# Altium schematic sheet MB1296-LRA_Module.SchDoc: LoRa Module
size A4; Date: 25-JAN-2017; Organization: STMicroelectronics; Address1: Microcontrollers Division; Address2: 190, avenue Célestin COQ; Address3: 13106 ROUSSET Cedex; Address4: FRANCE; DocumentNumber: MB1296; Revision: D-01; SheetNumber: 4; SheetTotal: 6; Project: STM32 LoRa Discovery
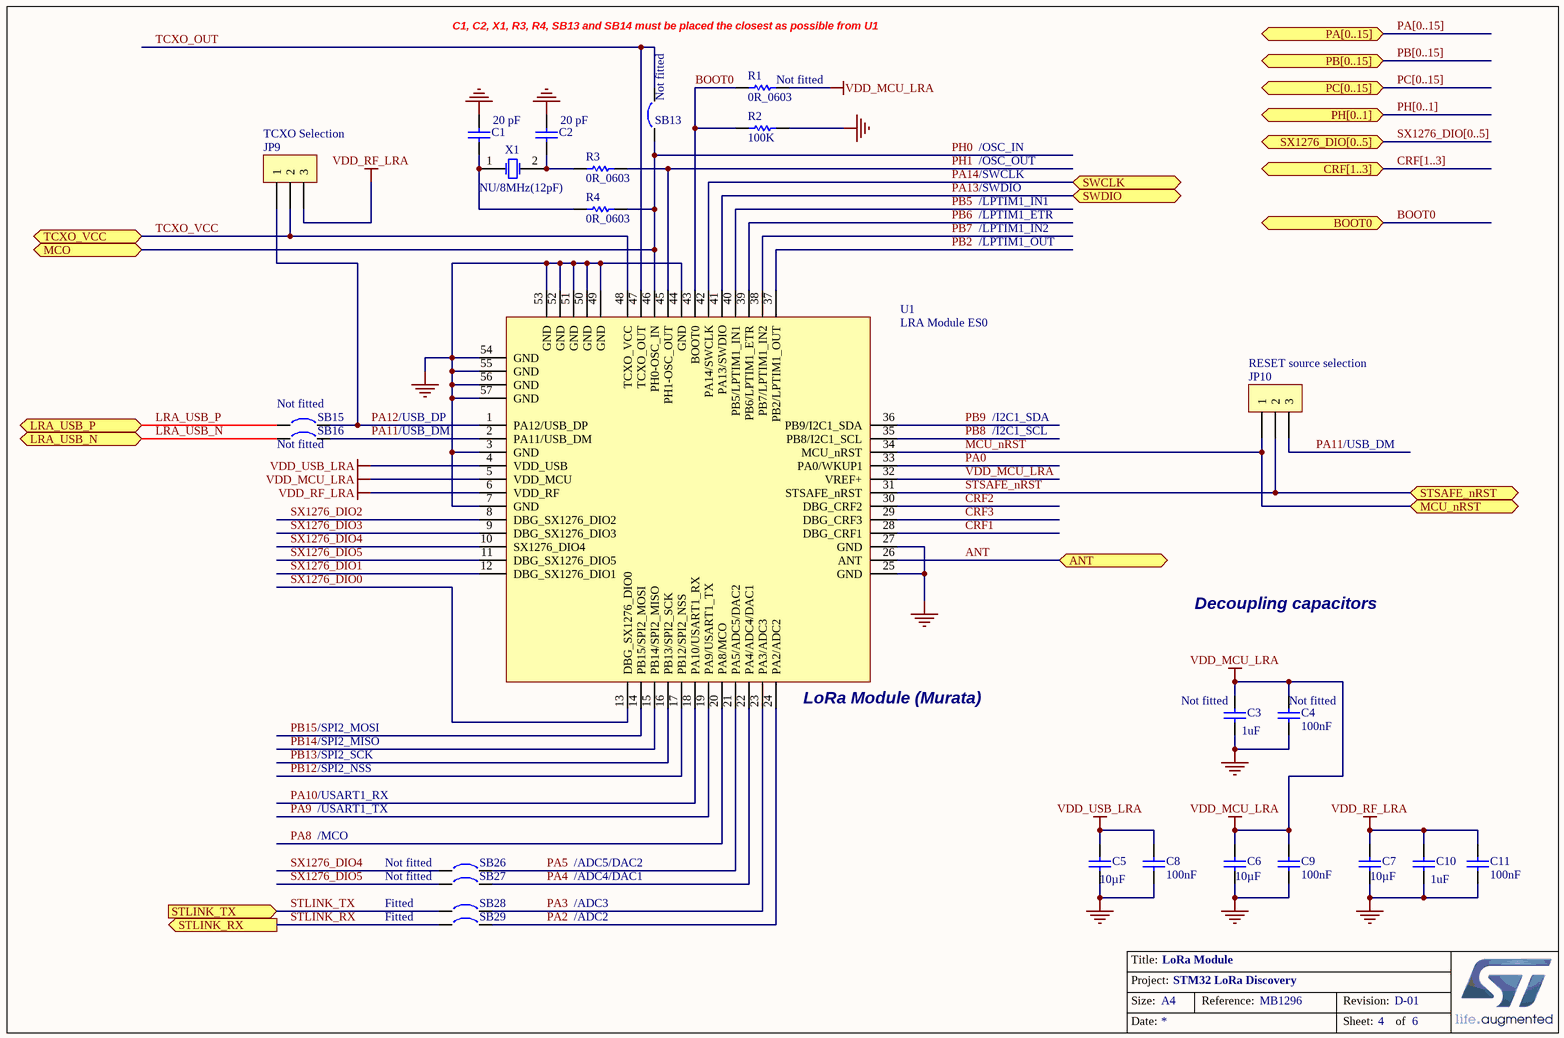
[diagram p0: MB1296-LRA_Module.SchDoc]

## Parts
C1  20 pF  [0603C]
C2  20 pF  [0603C]
C3  1uF  [0603C]
C4  100nF  [0603C]
C5  10µF  [0603C]
C6  10µF  [0603C]
C7  10µF  [0603C]
C8  100nF  [0603C]
C9  100nF  [0603C]
C10  1uF  [0603C]
C11  100nF  [0603C]
JP9  TCXO Selection  [SIP3]
JP10  RESET source selection  [SIP3]
R1  0R_0603  [0603]
R2  100K  [0603]
R3  0R_0603  [0603]
R4  0R_0603  [0603]
SB13  Circuit Breaker  [JP2_SMD]  (value not drawn)
SB15  Circuit Breaker  [JP2_SMD]  (value not drawn)
SB16  Circuit Breaker  [JP2_SMD]  (value not drawn)
SB26  Circuit Breaker  [JP2_SMD]  (value not drawn)
SB27  Circuit Breaker  [JP2_SMD]  (value not drawn)
SB28  Circuit Breaker  [JP2_SMD]  (value not drawn)
SB29  Circuit Breaker  [JP2_SMD]  (value not drawn)
U1  LRA Module ES0  [Lora Module ES0]
X1  NU/8MHz(12pF)  [CRY_NX3225GD_2P]

## Ports
ANT, BOOT0, CRF[1..3], LRA_USB_N, LRA_USB_P, MCO, MCU_nRST, PA[0..15] (bidir), PB[0..15] (bidir), PC[0..15] (bidir), PH[0..1] (bidir), STLINK_RX (out), STLINK_TX (in), STSAFE_nRST, SWCLK, SWDIO, SX1276_DIO[0..5] (bidir), TCXO_VCC

## Nets
GND: C1.2 C2.2 C3.1 C4.1 C5.2 C6.2 C7.2 C8.1 C9.1 C10.1 C11.1 R2.1 U1.3(GND) U1.7(GND) U1.25(GND) U1.27(GND) U1.44(GND) U1.49(GND) U1.50(GND) U1.51(GND) U1.52(GND) U1.53(GND) U1.54(GND) U1.55(GND) U1.56(GND) U1.57(GND)
VDD_MCU_LRA: C3.2 C4.2 C6.1 C9.2 R1.2 U1.5(VDD_MCU) U1.32(VREF+)
VDD_RF_LRA: C7.1 C10.2 C11.2 JP9.3 U1.6(VDD_RF)
VDD_USB_LRA: C5.1 C8.2 U1.4(VDD_USB)
ANT: U1.26(ANT) ; port ANT
BOOT0: R1.1 R2.2 U1.43(BOOT0) ; port BOOT0
CRF1: U1.28(DBG_CRF1)
CRF2: U1.30(DBG_CRF2)
CRF3: U1.29(DBG_CRF3)
LRA_USB_N: SB16.1 ; port LRA_USB_N
LRA_USB_P: SB15.1 ; port LRA_USB_P
MCU_nRST: JP10.1 U1.34(MCU_nRST) ; port MCU_nRST
PA0: U1.33(PA0/WKUP1)
PA2: SB29.2 U1.24(PA2/ADC2)
PA3: SB28.2 U1.23(PA3/ADC3)
PA4: SB27.2 U1.22(PA4/ADC4/DAC1)
PA5: SB26.2 U1.21(PA5/ADC5/DAC2)
PA8: U1.20(PA8/MCO)
PA9: U1.19(PA9/USART1_TX)
PA10: U1.18(PA10/USART1_RX)
PA11: JP10.3 SB16.2 U1.2(PA11/USB_DM)
PA12: JP9.1 SB15.2 U1.1(PA12/USB_DP)
PA13: U1.41(PA13/SWDIO) ; port SWDIO
PA14: U1.42(PA14/SWCLK) ; port SWCLK
PB2: U1.37(PB2/LPTIM1_OUT)
PB5: U1.40(PB5/LPTIM1_IN1)
PB6: U1.39(PB6/LPTIM1_ETR)
PB7: U1.38(PB7/LPTIM1_IN2)
PB8: U1.35(PB8/I2C1_SCL)
PB9: U1.36(PB9/I2C1_SDA)
PB12: U1.17(PB12/SPI2_NSS)
PB13: U1.16(PB13/SPI2_SCK)
PB14: U1.15(PB14/SPI2_MISO)
PB15: U1.14(PB15/SPI2_MOSI)
PH0: R4.2 SB13.1 U1.46(PH0-OSC_IN) ; port MCO
PH1: R3.2 U1.45(PH1-OSC_OUT)
STLINK_RX: SB29.1 ; port STLINK_RX
STLINK_TX: SB28.1 ; port STLINK_TX
STSAFE_nRST: JP10.2 U1.31(STSAFE_nRST) ; port STSAFE_nRST
SX1276_DIO0: U1.13(DBG_SX1276_DIO0)
SX1276_DIO1: U1.12(DBG_SX1276_DIO1)
SX1276_DIO2: U1.8(DBG_SX1276_DIO2)
SX1276_DIO3: U1.9(DBG_SX1276_DIO3)
SX1276_DIO4: SB26.1 U1.10(SX1276_DIO4)
SX1276_DIO5: SB27.1 U1.11(DBG_SX1276_DIO5)
TCXO_OUT: SB13.2 U1.47(TCXO_OUT)
TCXO_VCC: JP9.2 U1.48(TCXO_VCC) ; port TCXO_VCC
NetC1_1: C1.1 R4.1 X1.1(OSC1)
NetC2_1: C2.1 R3.1 X1.2(OSC2)

## Buses and harness runs
bus CRF[1..3] = port CRF[1..3]
bus PA[0..15] = port PA[0..15]
bus PB[0..15] = port PB[0..15]
bus PC[0..15] = port PC[0..15]
bus PH[0..1] = port PH[0..1]
bus SX1276_DIO[0..5] = port SX1276_DIO[0..5]

## Notes on the sheet
- C1, C2, X1, R3, R4, SB13 and SB14 must be placed the closest as possible from U1
- (near SB13) Not fitted
- (near R1) Not fitted
- /OSC_IN
- /OSC_OUT
- /SWCLK
- /SWDIO
- /LPTIM1_IN1
- /LPTIM1_ETR
- /LPTIM1_IN2
- /LPTIM1_OUT
- (near SB15) Not fitted
- (near SB16) Not fitted
- /USB_DP
- /USB_DM
- /I2C1_SDA
- /I2C1_SCL
- Decoupling capacitors
- (near U1) LoRa Module (Murata)
- (near C3) Not fitted
- (near C4) Not fitted
- /SPI2_MOSI
- /SPI2_MISO
- /SPI2_SCK
- /SPI2_NSS
- /USART1_RX
- /USART1_TX
- /MCO
- (near SB26) Not fitted
- Not fitted
- Fitted
- /ADC5/DAC2
- /ADC4/DAC1
- /ADC3
- /ADC2
- Title:
- Project:
- Size:
- Date:
- A4
- Reference:
- Sheet:
- Revision:
- of

## Library data of the parts
C1 C2 = Capacitor_ST: Capacitor 0603; Manufacturer: YAGEO; Manufacturer P/N: CC0603JRNPO9BN200; Value: 20pF; Fitted: No; Provided by: Subcon; Revision: July-2002: Re-released for DXP Platform.; ECCN_US/UE: *; Order Code Digikey: *; Order Code Farnell: *; Order Code RS: *
C3 = CAP SMD 0603  X5R 1µF 25V 10%: 0603  X5R 1µF; Manufacturer: YAGEO; Manufacturer P/N: CC0603KRX5R7BB105; Fitted: No; Provided by: Subcon; Order code Farnell: 1288202RL; Value: 1µF; ECCN_US/UE: *; Order Code Digikey: *
C4 C11 = CAP: Capacitor 100nF; Manufacturer: YAGEO; Manufacturer P/N: CC0603KRX7R9BB104; Fitted: No; Provided by: Subcon; Revision: July-2002: Re-released for DXP Platform.; Value: 100nF; ECCN_US/UE: *; Order Code Digikey: *; Order Code Farnell: *; Order Code RS: *
C5-C7 = CAP_C0805C106K8RACTU: Capacitor SMD 0805 10000000pF X7R 10V +/-10%; Manufacturer: Kemet; Order code RS: ...; Tolerance: 10%; Fitted: Yes; Manufacturer P/N: C0805C106K8RACTU; Order code Farnell: 2118132; Value: 10µF; Rated voltage: 10V; Technology: X7R; Temperature Max: +125°C; Temperature Min: -55°C; Order code Digikey: 399-7411-1-ND
C8 C9 = CAP: Capacitor 100nF; Manufacturer: YAGEO; Manufacturer P/N: CC0603KRX7R9BB104; Provided by: Subcon; Revision: July-2002: Re-released for DXP Platform.; Value: 100nF; ECCN_US/UE: *; Fitted: *; Order Code Digikey: *; Order Code Farnell: *; Order Code RS: *
C10 = CAP SMD 0603  X5R 1µF 25V 10%: 0603  X5R 1µF; Manufacturer: YAGEO; Manufacturer P/N: CC0603KRX5R7BB105; Provided by: Subcon; Order code Farnell: 1288202RL; Value: 1µF; ECCN_US/UE: *; Fitted: *; Order Code Digikey: *
JP9 JP10 = Header 3: Manufacturer: Kontek; Manufacturer P/N: 4710334140400; Order Code RS: 423-2835; Provided by: Subcon; Order Code Farnell: *; ECCN_US/UE: *; Fitted: *; Order Code Digikey: *; Value: *
R1 = RES SMD 0603 0R 50V 0.1W: 0603 0R 50V 0.1W; Manufacturer: YAGEO; Manufacturer P/N: RC0603JR-070RL; Order code RS: 6555461; Fitted: No; Order code Farnell: 9233130; Value: 0R; ECCN_US/UE: *; Order Code Digikey: *; Provided by: *
R2 = RES SMD 0603 100K 75V 5% 0.1W: 0603 100K 75V 5% 0.1W; Manufacturer: YAGEO; Manufacturer P/N: RC0603FR-07100KL; Provided by: Subcon; Order code Farnell: 1692517; Value: 100K; ECCN_US/UE: *; Fitted: *; Order Code Digikey: *
R3 R4 = RES SMD 0603 0R 50V 0.1W: 0603 0R 50V 0.1W; Manufacturer: YAGEO; Manufacturer P/N: RC0603JR-070RL; Order code RS: 6555461; Order code Farnell: 9233130; Value: 0R; ECCN_US/UE: *; Fitted: *; Order Code Digikey: *; Provided by: *
SB13 SB15 SB16 SB26 SB27 = Circuit Breaker: Fitted: No; Revision: July-2002: Re-released for DXP Platform.; ECCN_US/UE: *; Manufacturer: *; Manufacturer P/N: *; Order Code Digikey: *; Order Code Farnell: *; Order Code RS: *; Provided by: *; Value: *
SB28 SB29 = Circuit Breaker: Fitted: Yes; Revision: July-2002: Re-released for DXP Platform.; ECCN_US/UE: *; Manufacturer: *; Manufacturer P/N: *; Order Code Digikey: *; Order Code Farnell: *; Order Code RS: *; Provided by: *; Value: *
U1 = LRA Module ES0: Manufacturer: Murata; Manufacturer P/N: LoRa Module ES0; ECCN_US/UE: *; Fitted: *; Order Code Digikey: *; Order Code Farnell: *; Order Code RS: *; Provided by: Murata; Value: *
X1 = XTAL: Crystal Oscillator; Manufacturer: HongKongCrystal; Manufacturer P/N: 9SL8000012AFXHF0-SJ28; Fitted: No; Provided by: Subcon; Value: 8MHz; ECCN_US/UE: *; Order Code Digikey: *; Order Code Farnell: *; Order Code RS: *